# Altium schematic sheet P02_AMOLED.SchDoc
size A4; SheetNumber: 2; SheetTotal: 7
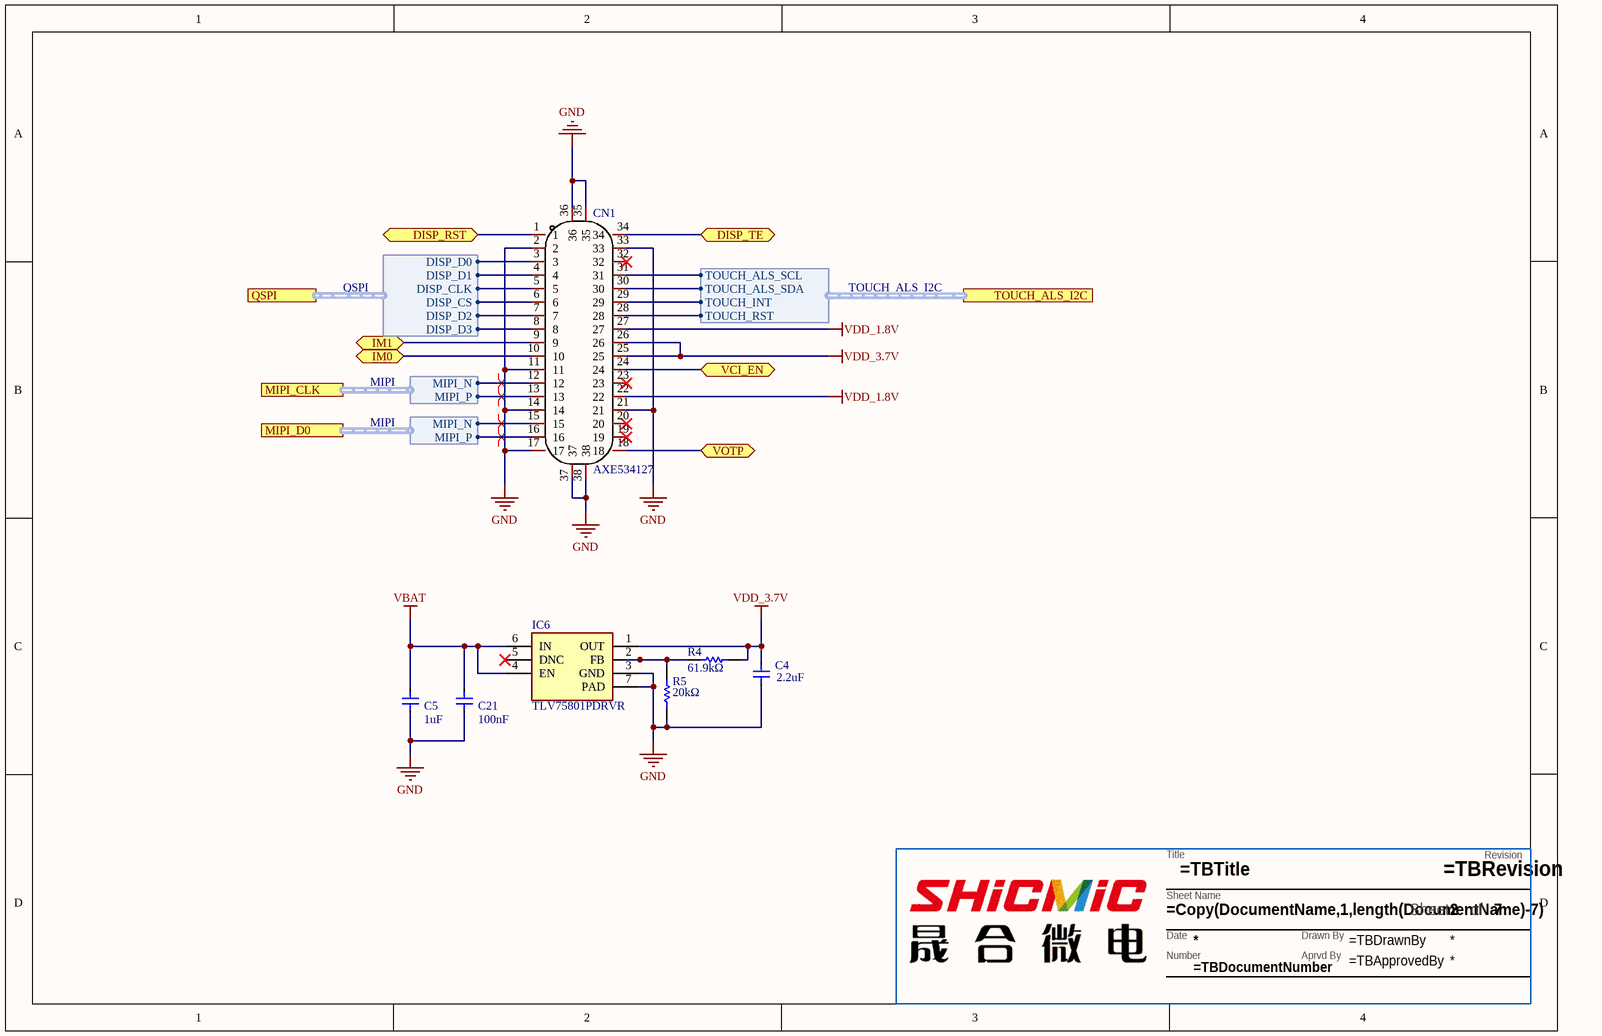
[diagram p0: P02_AMOLED.SchDoc]

## Parts
??  TitleBlock  (value not drawn)  (graphical)
C4  2.2uF  [CAP_0402]
C5  1uF  [CAP_0402]
C21  100nF  [CAP_0402]
CN1  AXE534127  [CONN-SMD_34P-P0.40_AXE534127]
IC6  TLV75801PDRVR  [SON65P200X200X80-7N]
R4  61.9kΩ  [RES_0402]
R5  20kΩ  [RES_0402]

## Ports
DISP_RST (bidir), DISP_TE (bidir), IM0 (bidir), IM1 (bidir), MIPI_CLK (harness MIPI), MIPI_D0 (harness MIPI), QSPI (harness QSPI), TOUCH_ALS_I2C (harness TOUCH_ALS_I2C), VCI_EN (bidir), VOTP (bidir)

## Harnesses
MIPI: MIPI_N, MIPI_P
QSPI: DISP_CLK, DISP_CS, DISP_D0, DISP_D1, DISP_D2, DISP_D3
TOUCH_ALS_I2C: TOUCH_ALS_SCL, TOUCH_ALS_SDA, TOUCH_INT, TOUCH_RST

## Nets
GND: C4.2 C5.2 C21.2 CN1.2 CN1.11 CN1.14 CN1.17 CN1.21 CN1.33 CN1.35 CN1.36 CN1.37 CN1.38 IC6.3(GND) IC6.7(PAD) R5.2
VBAT: C5.1 C21.1 IC6.4(EN) IC6.6(IN)
VDD_1.8V: CN1.22 CN1.27
VDD_3.7V: C4.1 CN1.25 CN1.26 IC6.1(OUT) R4.2
DISP_RST: CN1.1 ; port DISP_RST
DISP_TE: CN1.34 ; port DISP_TE
IM0: CN1.10 ; port IM0
IM1: CN1.9 ; port IM1
VCI_EN: CN1.24 ; port VCI_EN
VOTP: CN1.18 ; port VOTP
NetCN1_3: CN1.3 ; port QSPI.DISP_D0
NetCN1_4: CN1.4 ; port QSPI.DISP_D1
NetCN1_5: CN1.5 ; port QSPI.DISP_CLK
NetCN1_6: CN1.6 ; port QSPI.DISP_CS
NetCN1_7: CN1.7 ; port QSPI.DISP_D2
NetCN1_8: CN1.8 ; port QSPI.DISP_D3
NetCN1_12: CN1.12 ; port MIPI_CLK.MIPI_N
NetCN1_13: CN1.13 ; port MIPI_CLK.MIPI_P
NetCN1_15: CN1.15 ; port MIPI_D0.MIPI_N
NetCN1_16: CN1.16 ; port MIPI_D0.MIPI_P
NetCN1_28: CN1.28 ; port TOUCH_ALS_I2C.TOUCH_RST
NetCN1_29: CN1.29 ; port TOUCH_ALS_I2C.TOUCH_INT
NetCN1_30: CN1.30 ; port TOUCH_ALS_I2C.TOUCH_ALS_SDA
NetCN1_31: CN1.31 ; port TOUCH_ALS_I2C.TOUCH_ALS_SCL
NetIC6_2: IC6.2(FB) R4.1 R5.1

Not connected (* = marked no-connect by the designer): CN1 19* 20* 23* 32*; IC6 5(DNC)*

## Layout directives
differential pair: NetCN1_12, NetCN1_13, NetCN1_15, NetCN1_16

## Notes on the sheet
- (in symbol TitleBlock) Revision; Title; Sheet Name; Sheet; of; Date; Drawn By; Number; Aprvd By

## Library data of the parts
?? = TitleBlock: Title block for Ambiq Schematics. Please have the following parameters entered in Project>Project Options>Parameters: / TBTitle / TBDocumentNumber / TBRevision / TBDrawnBy / TBApprovedBy; AMBIQ PN: TitleBlock
C4 = Capacitor: NONE; Manufacturer: Samsung; AMBIQ PN: CL05A225KP5NNNC; Tolerance: 10%; Voltage Rating: 10V; Supplier 1: Arrow Electronics; Supplier Part Number 1: CL05A225KP5NNNC; Manufacturer Part Number: CL05A225KP5NNNC; RoHS: Yes; Category: Ceramic Capacitors; Stock 1: 32414; Pricing 1: 1=0.14620, 10=0.09980, 25=0.09880, 100=0.05200, 250=0.05150, 500=0.03630, 1000=0.02990, 3000=0.02760, 6000=0.02610, 15000=0.023; Mount: Surface Mount; Case/Package: 0402; Case Code (Metric): 1005; Case Code (Imperial): 0402; Min Operating Temperature: -55°C; Max Operating Temperature: 85°C; Capacitance: 2.2uF; Packaging: Tape and Reel; Voltage Rating (DC): 10V; Series: CL; Length: 0.039inch; Width: 0.02inch; Thickness: 0.022inch; RoHS Compliant: Yes; ComponentLink1URL: https://datasheet.ciiva.com/25727/cl05a225kp5nnnc-25727777.pdf?src-supplier=Digi-Key; ComponentLink1Description: https://datasheet.ciiva.com/25727/cl05a225kp5nnnc-25727777.pdf?src-supplier=Digi-Key; Package Quantity: 1
C5 = Capacitor: NONE; Manufacturer: Samsung; Manufacturer Part Number: CL05A105MP5NNNC; AMBIQ PN: CL05A105KP5NNNC; Tolerance: 20%; Voltage Rating: 10V; Dielectric: X5R; Supplier 1: Newark; Supplier Part Number 1: 82AC9184; RoHS: Yes; Category: Ceramic Capacitors; Mount: Surface Mount; Case/Package: 0402; Case Code (Metric): 1005; Case Code (Imperial): 0402; Min Operating Temperature: -55°C; Max Operating Temperature: 85°C; Capacitance: 1uF; Packaging: Tape and Reel; Voltage Rating (DC): 10V; Series: CL; Construction: Flat; Length: 1mm; Width: 0.02inch; Height: 0.5mm; Thickness: 0.022inch; Depth: 0.5mm; Radiation Hardening: No; Lead Free: Lead Free; RoHS Compliant: Yes; ComponentLink1URL: https://datasheet.ciiva.com/25802/cl05a105mp5nnnc-25802049.pdf?src-supplier=Digi-Key; ComponentLink1Description: https://datasheet.ciiva.com/25802/cl05a105mp5nnnc-25802049.pdf?src-supplier=Digi-Key; Package Quantity: 1
C21 = Capacitor: NONE; Manufacturer: Kyocera AVX; AMBIQ PN: 0201ZD104KAT2A; Tolerance: 10%; Voltage Rating: 10V; Supplier 1: Arrow Electronics; Supplier Part Number 1: 0201ZD104KAT2A; Manufacturer Part Number: 0201ZD104KAT2A; RoHS: Yes; Category: Ceramic Capacitors; Stock 1: 105000; Pricing 1: 15000=0.00770, 30000=0.00750, 45000=0.00740, 60000=0.00720, 75000=0.00690, 150000=0.00620 (USD); Mount: Surface Mount; Case/Package: 0201; Case Code (Metric): 0603; Case Code (Imperial): 0201; Min Operating Temperature: -55°C; Max Operating Temperature: 85°C; Capacitance: 100nF; Packaging: Tape and Reel; Voltage Rating (DC): 10V; Series: -; Lead Free: Lead Free; RoHS Compliant: Yes; ComponentLink1URL: http://www.mouser.com/ds/2/40/cx5r-776519.pdf?src-supplier=Mouser; ComponentLink1Description: http://www.mouser.com/ds/2/40/cx5r-776519.pdf?src-supplier=Mouser
CN1 = AXE534127: Add into BOM: yes; Symbol: AXE534127; Device: AXE534127; LCSC Part Name: AXE534127; Supplier Part: C9900017244; Manufacturer Part: AXE534127; Supplier Footprint: SMD-34; JLCPCB Part Class: 扩展库; Datasheet: https://atta.szlcsc.comnull; Supplier: LCSC; Convert to PCB: yes; Name: AXE534127
IC6 = TLV75801PDRVR: Integrated Circuit; Manufacturer_Name: Texas Instruments; Datasheet Link: http://www.ti.com/lit/gpn/TLV758P; Height: 0.8mm; Manufacturer_Part_Number: TLV75801PDRVR; Mouser Part Number: 595-TLV75801PDRVR; Mouser Price/Stock: https://www.mouser.co.uk/ProductDetail/Texas-Instruments/TLV75801PDRVR?qs=PqoDHHvF64%2FZ6DyDKfEo8A%3D%3D; Arrow Part Number: TLV75801PDRVR; Arrow Price/Stock: https://www.arrow.com/en/products/tlv75801pdrvr/texas-instruments?region=europe
R4 = Resistor: Res Thick Film 0402 61.9K Ohm 1% 1/10W +/-100ppm/ßC Molded SMD Punched Carrier T/R; Manufacturer: Panasonic; AMBIQ PN: ERJ-2RKF6192X; Resistance: 61.9kR; Power Rating: 100mW; Voltage Rating: 50V; Temperature Coefficient: 100ppm/°C; Supplier 1: Arrow Electronics; Supplier Part Number 1: ERJ-2RKF6192X; Manufacturer Part Number: ERJ-2RKF6192X; RoHS: Yes; Category: Chip SMD Resistors; Stock 1: 50040; Pricing 1: 1=0.05180, 10=0.02920, 25=0.02020 (USD); Mount: Surface Mount; Case/Package: 0402; Case Code (Metric): 1005; Case Code (Imperial): 0402; Contact Plating: Tin; Min Operating Temperature: -55°C; Max Operating Temperature: 155°C; Package Quantity: 1; Packaging: Tape and Reel; Resistor Type: Thick Film; Number of Terminations: 2; Termination: SMD/SMT; Max Power Dissipation: 100mW; Voltage Rating (DC): 50V; Features: Automotive AEC-Q200; Series: ERJ; Construction: Rectangular; Length: 1mm; Width: 0.02inch; Height: 0.016inch; Depth: 0.5mm; REACH SVHC: No SVHC; Military Standard: Not; Lead Free: Lead Free; RoHS Compliant: Yes; ComponentLink1URL: https://datasheet.ciiva.com/31404/1678782-31404872.pdf?src-supplier=Farnell; ComponentLink1Description: https://datasheet.ciiva.com/31404/1678782-31404872.pdf?src-supplier=Farnell; ComponentLink2URL: https://datasheet.ciiva.com/6201/426256-6201383.pdf?src-supplier=Farnell; ComponentLink2Description: https://datasheet.ciiva.com/6201/426256-6201383.pdf?src-supplier=Farnell; ComponentLink3URL: https://datasheet.ciiva.com/43460/426256-43460335.pdf?src-supplier=Farnell; Tolerance: 1%; Resistance Tolerance: 1%
R5 = Resistor: Res Thick Film 0402 20K Ohm 1% 1/16W ±100ppm/°C Molded SMD Paper T/R; Manufacturer: Vishay; AMBIQ PN: CRCW040220K0FKED; Resistance: 20kR; Power Rating: 63mW; Voltage Rating: 50V; Supplier 1: Newark; Supplier Part Number 1: 24W2083; Manufacturer Part Number: CRCW040220K0FKED; RoHS: Yes; Category: Chip SMD Resistors; Stock 1: 380000; Pricing 1: 1=0.00600, 10000=0.00600 (USD); Mount: Surface Mount; Case/Package: 0402; Weight: 2.3E-05oz; Case Code (Metric): 1005; Case Code (Imperial): 0402; Contact Plating: Tin; Min Operating Temperature: -55°C; Max Operating Temperature: 155°C; Package Quantity: 10; Packaging: Tape and Reel; Resistor Type: Thick Film; Number of Terminations: 2; Termination: SMD/SMT; Max Power Dissipation: 63mW; Temperature Coefficient: 100ppm/°C; Voltage Rating (DC): 50V; Features: Automotive AEC-Q200; Series: CRCW; Technology: THICK FILM; Construction: Rectangular; Length: 1mm; Width: 0.5mm; Height: 0.35mm; Depth: 0.5mm; Radiation Hardening: No; REACH SVHC: Unknown; Military Standard: Not; Lead Free: Lead Free; RoHS Compliant: Yes; ComponentLink1URL: https://datasheet.ciiva.com/11810/0900766b80d98824-11810023.pdf?src-supplier=RSComponents; ComponentLink1Description: https://datasheet.ciiva.com/11810/0900766b80d98824-11810023.pdf?src-supplier=RSComponents; ComponentLink2URL: https://datasheet.ciiva.com/2463/dcrcwe3-2463139.pdf?src-supplier=Digi-Key; ComponentLink2Description: https://datasheet.ciiva.com/2463/dcrcwe3-2463139.pdf?src-supplier=Digi-Key; ComponentLink3URL: https://datasheet.ciiva.com/2463/dcrcwe3-2463140.pdf?src-supplier=Digi-Key; Tolerance: 1%; Number of Pins: 2; Resistance Tolerance: 1%; Working Voltage: 50V